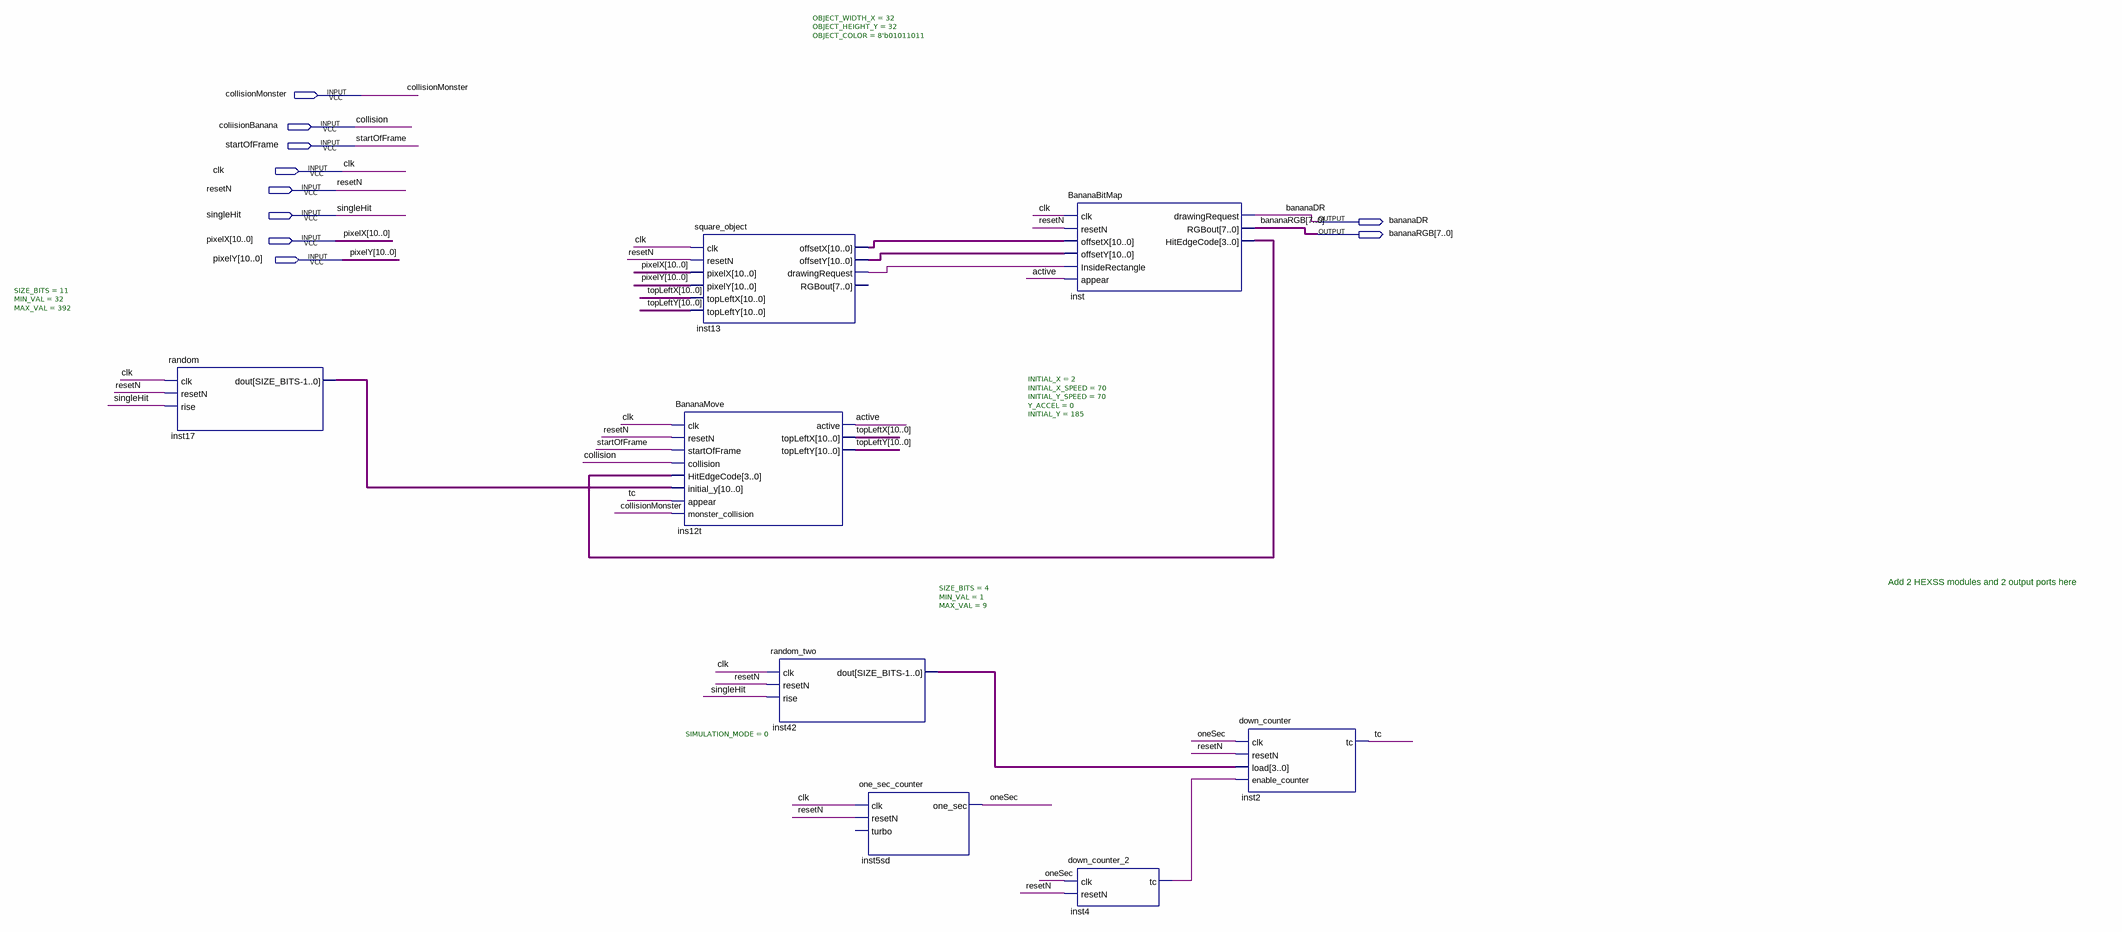
[diagram p0: schematic sheet]
// Quartus schematic Banana.bdf as structural Verilog: 8 symbols, 10 pins
module Banana (
  input  collisionMonster,
  input  coliisionBanana,
  input  startOfFrame,
  input  clk,
  input  resetN,
  input  singleHit,
  input  [10:0] pixelX,
  input  [10:0] pixelY,
  output bananaDR,
  output [7:0] bananaRGB
);

  wire active, inst4_tc, inst13_drawingrequest, oneSec, tc;
  wire [3:0] inst42_dout, inst_hitedgecode;
  wire [10:0] inst13_offsetx, inst13_offsety, inst17_dout, topLeftX, topLeftY;

  random #(.SIZE_BITS(11), .MIN_VAL(32), .MAX_VAL(392)) inst17 (
    .clk(clk), .resetN(resetN), .rise(singleHit), .dout(inst17_dout));
  BananaMove #(.INITIAL_X(2), .INITIAL_X_SPEED(70), .INITIAL_Y_SPEED(70), .Y_ACCEL(0), .INITIAL_Y(185)) ins12t (
    .clk(clk), .resetN(resetN), .startOfFrame(startOfFrame), .collision(coliisionBanana),
    .HitEdgeCode(inst_hitedgecode), .initial_y(inst17_dout), .appear(tc),
    .monster_collision(collisionMonster), .active(active), .topLeftX(topLeftX), .topLeftY(topLeftY));
  square_object #(.OBJECT_WIDTH_X(32), .OBJECT_HEIGHT_Y(32), .OBJECT_COLOR(8'b01011011)) inst13 (
    .clk(clk), .resetN(resetN), .pixelX(pixelX), .pixelY(pixelY), .topLeftX(topLeftX), .topLeftY(topLeftY),
    .offsetX(inst13_offsetx), .offsetY(inst13_offsety), .drawingRequest(inst13_drawingrequest));  // open: RGBout
  random_two #(.SIZE_BITS(4), .MIN_VAL(1), .MAX_VAL(9)) inst42 (
    .clk(clk), .resetN(resetN), .rise(singleHit), .dout(inst42_dout));
  one_sec_counter #(.SIMULATION_MODE(0)) inst5sd (.clk(clk), .resetN(resetN), .one_sec(oneSec));  // open: turbo
  BananaBitMap inst (
    .clk(clk), .resetN(resetN), .offsetX(inst13_offsetx), .offsetY(inst13_offsety),
    .InsideRectangle(inst13_drawingrequest), .appear(active), .drawingRequest(bananaDR), .RGBout(bananaRGB),
    .HitEdgeCode(inst_hitedgecode));
  down_counter_2 inst4 (.clk(oneSec), .resetN(resetN), .tc(inst4_tc));
  down_counter inst2 (.clk(oneSec), .resetN(resetN), .load(inst42_dout), .enable_counter(inst4_tc), .tc(tc));

  // Other names for the same wires on the sheet: collision = coliisionBanana

  // Notes on the sheet:
  //   Add 2 HEXSS modules and 2 output ports here
endmodule
